# EAGLE design tmc2209 (EAGLE 7.3.0)
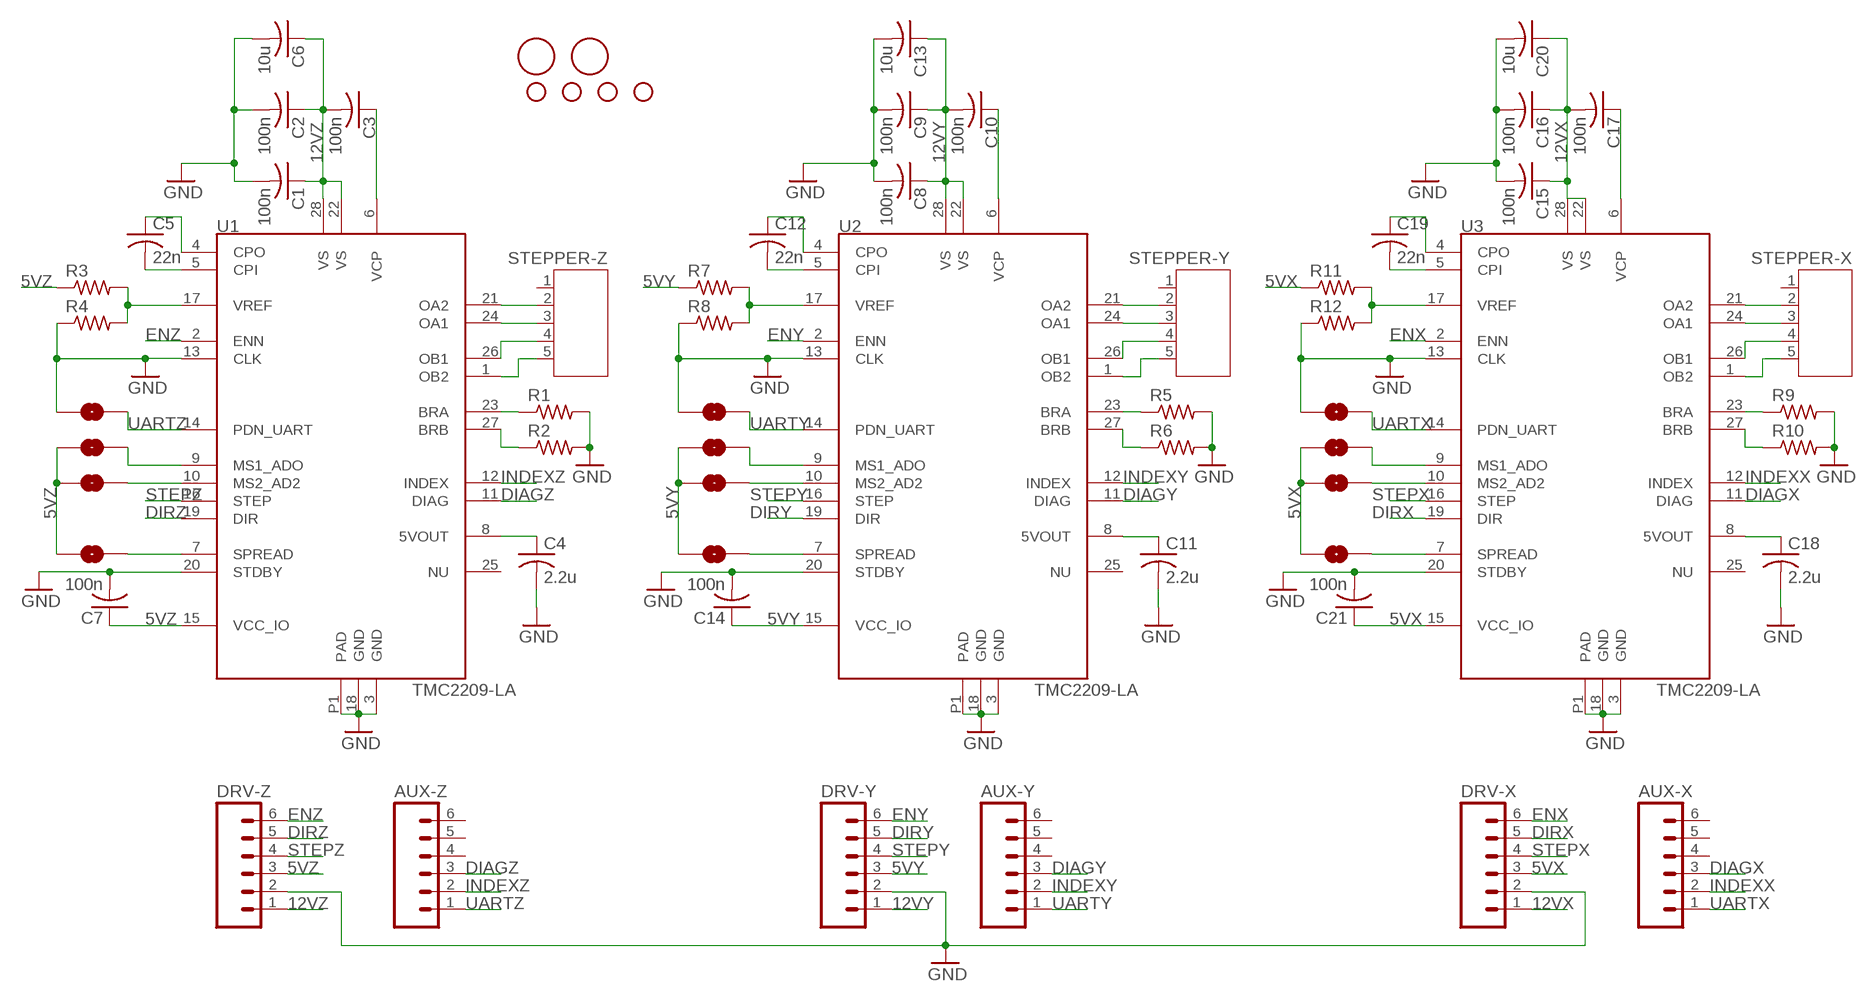
[diagram p0: schematic, sheet 1]

## Parts
AUX-X  M06LOCK  [1X06_LOCK]
AUX-Y  M06LOCK  [1X06_LOCK]
AUX-Z  M06LOCK  [1X06_LOCK]
C1  100n  C-USC0603  [C0603]
C2  100n  C-USC0603  [C0603]
C3  100n  C-USC0603  [C0603]
C4  2.2u  C-USC1206  [C1206]
C5  22n  C-USC0603  [C0603]
C6  10u  C-USC1206  [C1206]
C7  100n  C-USC0603  [C0603]
C8  100n  C-USC0603  [C0603]
C9  100n  C-USC0603  [C0603]
C10  100n  C-USC0603  [C0603]
C11  2.2u  C-USC1206  [C1206]
C12  22n  C-USC0603  [C0603]
C13  10u  C-USC1206  [C1206]
C14  100n  C-USC0603  [C0603]
C15  100n  C-USC0603  [C0603]
C16  100n  C-USC0603  [C0603]
C17  100n  C-USC0603  [C0603]
C18  2.2u  C-USC1206  [C1206]
C19  22n  C-USC0603  [C0603]
C20  10u  C-USC1206  [C1206]
C21  100n  C-USC0603  [C0603]
DRV-X  M06LOCK  [1X06_LOCK]
DRV-Y  M06LOCK  [1X06_LOCK]
DRV-Z  M06LOCK  [1X06_LOCK]
PDX  SOLDERJUMPERNO  [SJ_2S-NO]
PDY  SOLDERJUMPERNO  [SJ_2S-NO]
PDZ  SOLDERJUMPERNO  [SJ_2S-NO]
R1  R-US_R0805  [R0805]
R2  R-US_R0805  [R0805]
R3  R-US_R0603  [R0603]
R4  R-US_R0603  [R0603]
R5  R-US_R0805  [R0805]
R6  R-US_R0805  [R0805]
R7  R-US_R0603  [R0603]
R8  R-US_R0603  [R0603]
R9  R-US_R0805  [R0805]
R10  R-US_R0805  [R0805]
R11  R-US_R0603  [R0603]
R12  R-US_R0603  [R0603]
SJ2  SOLDERJUMPERNO  [SJ_2S-NO]
SJ3  SOLDERJUMPERNO  [SJ_2S-NO]
SJ5  SOLDERJUMPERNO  [SJ_2S-NO]
SJ6  SOLDERJUMPERNO  [SJ_2S-NO]
SJ8  SOLDERJUMPERNO  [SJ_2S-NO]
SJ9  SOLDERJUMPERNO  [SJ_2S-NO]
SJ10  SOLDERJUMPERNO  [SJ_2S-NO]
SJ11  SOLDERJUMPERNO  [SJ_2S-NO]
SJ12  SOLDERJUMPERNO  [SJ_2S-NO]
STANDOFF1  STAND-OFFTIGHT  [STAND-OFF-TIGHT]
STANDOFF2  STAND-OFFTIGHT  [STAND-OFF-TIGHT]
STANDOFF3  STAND-OFFTIGHT  [STAND-OFF-TIGHT]
STANDOFF4  STAND-OFFTIGHT  [STAND-OFF-TIGHT]
STEPPER-X  JST-PH5  [JST-PH5]
STEPPER-Y  JST-PH5  [JST-PH5]
STEPPER-Z  JST-PH5  [JST-PH5]
U1  TMC2209-LA  [QFN28-5X5-XLEP]
U2  TMC2209-LA  [QFN28-5X5-XLEP]
U3  TMC2209-LA  [QFN28-5X5-XLEP]
U$1  FIDUCIAL  [FIDUCIAL_1MM]
U$2  FIDUCIAL  [FIDUCIAL_1MM]

## Nets
5VX: C21.1 DRV-X.3 R11.1 SJ8.1 SJ9.1 SJ12.1 U3.15(VCC_IO)
5VY: C14.1 DRV-Y.3 R7.1 SJ5.1 SJ6.1 SJ11.1 U2.15(VCC_IO)
5VZ: C7.1 DRV-Z.3 R3.1 SJ2.1 SJ3.1 SJ10.1 U1.15(VCC_IO)
12VX: C15.1 C16.1 C17.2 C20.1 DRV-X.1 U3.22(VS) U3.28(VS)
12VY: C8.1 C9.1 C10.2 C13.1 DRV-Y.1 U2.22(VS) U2.28(VS)
12VZ: C1.1 C2.1 C3.2 C6.1 DRV-Z.1 U1.22(VS) U1.28(VS)
DIAGX: AUX-X.3 U3.11(DIAG)
DIAGY: AUX-Y.3 U2.11(DIAG)
DIAGZ: AUX-Z.3 U1.11(DIAG)
DIRX: DRV-X.5 U3.19(DIR)
DIRY: DRV-Y.5 U2.19(DIR)
DIRZ: DRV-Z.5 U1.19(DIR)
ENX: DRV-X.6 U3.2(ENN)
ENY: DRV-Y.6 U2.2(ENN)
ENZ: DRV-Z.6 U1.2(ENN)
GND: C1.2 C2.2 C4.2 C6.2 C7.2 C8.2 C9.2 C11.2 C13.2 C14.2 C15.2 C16.2 C18.2 C20.2 C21.2 DRV-X.2 DRV-Y.2 DRV-Z.2 PDX.1 PDY.1 PDZ.1 R1.2 R2.2 R4.1 R5.2 R6.2 R8.1 R9.2 R10.2 R12.1 U1.3(GND) U1.13(CLK) U1.18(GND) U1.20(STDBY) U1.P1(PAD) U2.3(GND) U2.13(CLK) U2.18(GND) U2.20(STDBY) U2.P1(PAD) U3.3(GND) U3.13(CLK) U3.18(GND) U3.20(STDBY) U3.P1(PAD)
INDEXX: AUX-X.2 U3.12(INDEX)
INDEXY: AUX-Y.2 U2.12(INDEX)
INDEXZ: AUX-Z.2 U1.12(INDEX)
N$1: STEPPER-Z.5 U1.1(OB2)
N$2: STEPPER-Z.4 U1.26(OB1)
N$3: STEPPER-Z.3 U1.24(OA1)
N$4: STEPPER-Z.2 U1.21(OA2)
N$5: STEPPER-Y.5 U2.1(OB2)
N$6: STEPPER-Y.4 U2.26(OB1)
N$7: STEPPER-Y.3 U2.24(OA1)
N$8: STEPPER-Y.2 U2.21(OA2)
N$9: STEPPER-X.2 U3.21(OA2)
N$10: STEPPER-X.3 U3.24(OA1)
N$11: STEPPER-X.4 U3.26(OB1)
N$12: STEPPER-X.5 U3.1(OB2)
N$13: R5.1 U2.23(BRA)
N$14: C11.1 U2.8(5VOUT)
N$15: SJ2.2 U1.9(MS1_ADO)
N$16: SJ3.2 U1.10(MS2_AD2)
N$17: SJ6.2 U2.10(MS2_AD2)
N$18: R6.1 U2.27(BRB)
N$19: C18.1 U3.8(5VOUT)
N$20: C17.1 U3.6(VCP)
N$22: C12.2 U2.5(CPI)
N$23: C12.1 U2.4(CPO)
N$24: C19.2 U3.5(CPI)
N$25: SJ5.2 U2.9(MS1_ADO)
N$26: C19.1 U3.4(CPO)
N$27: SJ12.2 U3.7(SPREAD)
N$28: SJ11.2 U2.7(SPREAD)
N$29: SJ9.2 U3.10(MS2_AD2)
N$30: SJ8.2 U3.9(MS1_ADO)
N$31: R11.2 R12.2 U3.17(VREF)
N$32: R7.2 R8.2 U2.17(VREF)
N$34: C10.1 U2.6(VCP)
N$40: SJ10.2 U1.7(SPREAD)
N$51: R9.1 U3.23(BRA)
N$52: R10.1 U3.27(BRB)
N$53: R1.1 U1.23(BRA)
N$54: R2.1 U1.27(BRB)
N$55: R3.2 R4.2 U1.17(VREF)
N$56: C4.1 U1.8(5VOUT)
N$57: C5.2 U1.5(CPI)
N$58: C5.1 U1.4(CPO)
N$59: C3.1 U1.6(VCP)
STEPX: DRV-X.4 U3.16(STEP)
STEPY: DRV-Y.4 U2.16(STEP)
STEPZ: DRV-Z.4 U1.16(STEP)
UARTX: AUX-X.1 PDX.2 U3.14(PDN_UART)
UARTY: AUX-Y.1 PDY.2 U2.14(PDN_UART)
UARTZ: AUX-Z.1 PDZ.2 U1.14(PDN_UART)
Unconnected: AUX-X.4 AUX-X.5 AUX-X.6 AUX-Y.4 AUX-Y.5 AUX-Y.6 AUX-Z.4 AUX-Z.5 AUX-Z.6 STEPPER-X.1 STEPPER-Y.1 STEPPER-Z.1 U1.25(NU) U2.25(NU) U3.25(NU)

## Library data of the parts
AUX-X AUX-Y AUX-Z DRV-X DRV-Y DRV-Z = SparkFun-Connectors:M06: Header 6 Standard 6-pin 0.1" header. Use with straight break away headers (SKU : PRT-00116), right angle break away headers (PRT-00553), swiss pins (PRT-00743), machine pins (PRT-00117), and female headers (PRT-00115). Molex polarized connector foot print use with SKU : PRT-08094 with associated crimp pins and housings. NOTES ON THE VARIANTS LOCK and LOCK_LONGPADS... This footprint was designed to help hold the alignment of a through-hole component (i.e. 6-pin header) while soldering it into place. You may notice that each hole has been shifted either up or down by 0.005 of an inch from it's more standard position (which is a perfectly straight line). This slight alteration caused the pins (the squares in the middle) to touch the edges of the holes. Because they are alternating, it causes a "brace" to hold the component in place. 0.005 has proven to be the perfect amount of "off-center" position when using our standard breakaway headers. Although looks a little odd when you look at the bare footprint, once you have a header in there, the alteration is very hard to notice. Also,if you push a header all the way into place, it is covered up entirely on the bottom side. This idea of altering the position of holes to aid alignment will be further integrated into the Sparkfun Library for other footprints. It can help hold any component with 3 or more connection pins.
C1-C21 = adafruit:C-US: CAPACITOR, American symbol
PDX PDY PDZ SJ2 SJ3 SJ5 SJ6 SJ8-SJ12 = SparkFun-Retired:SOLDERJUMPER: Solder Jumper Standard SMD solder jumper. Used to automate production. Two varients : Normally Open and Normally Closed are the same, but have different paste layers. NC will have a large amount of paste and should jumper during reflow.
R1-R12 = adafruit:R-US_: RESISTOR, American symbol
STANDOFF1-STANDOFF4 = SparkFun-Electromechanical:STAND-OFF: #4 Stand Off This is the mechanical footprint for a #4 phillips button head screw. Use the keepout ring to avoid running the screw head into surrounding components. SKU : PRT-00447
STEPPER-X STEPPER-Y STEPPER-Z = jst-ph:JST-PH5
U1-U3 = borkedlabs-powerics:TMC2209; MPN: TMC2209-LA; PACKAGE: QFN28-5x5
U$1 U$2 = adafruit:FIDUCIAL: For use by pick and place machines to calibrate the vision/machine, 1mm By microbuilder.eu

## Board
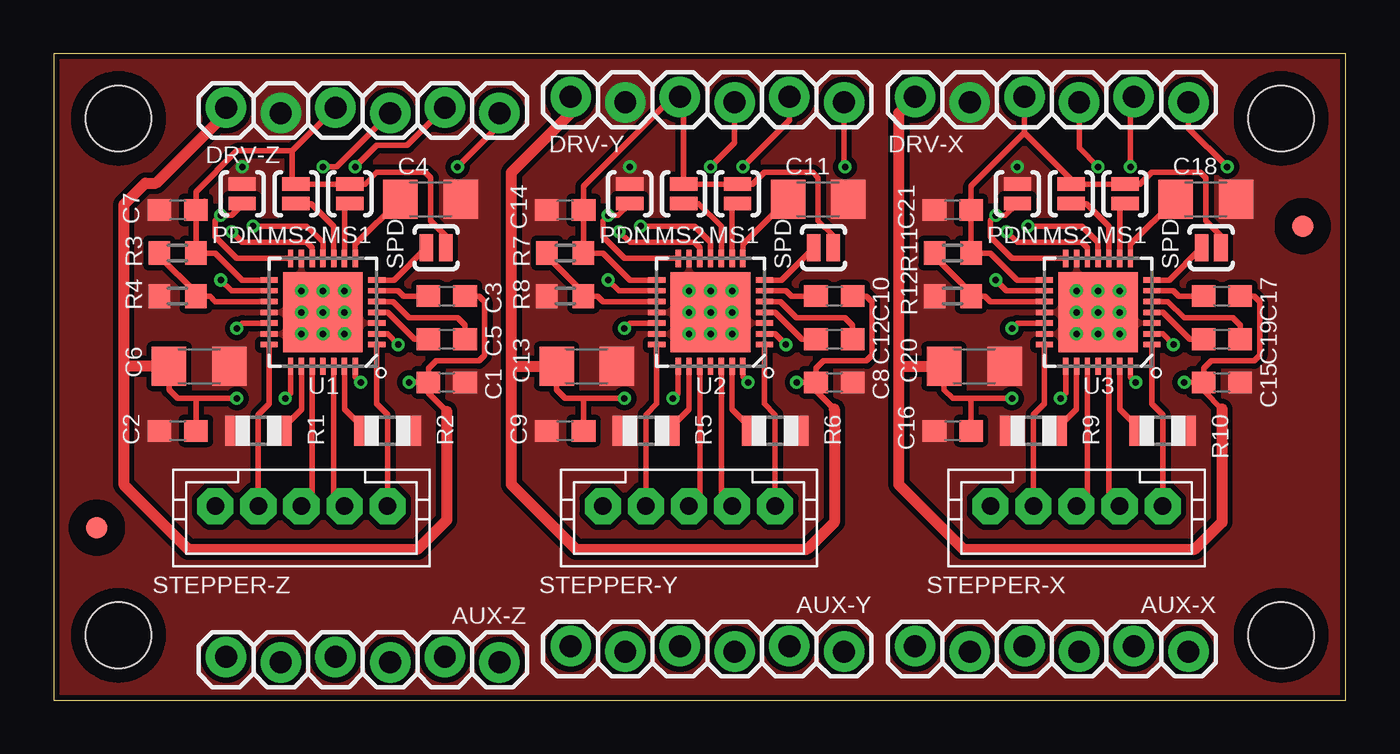
[diagram p1: board, top side]
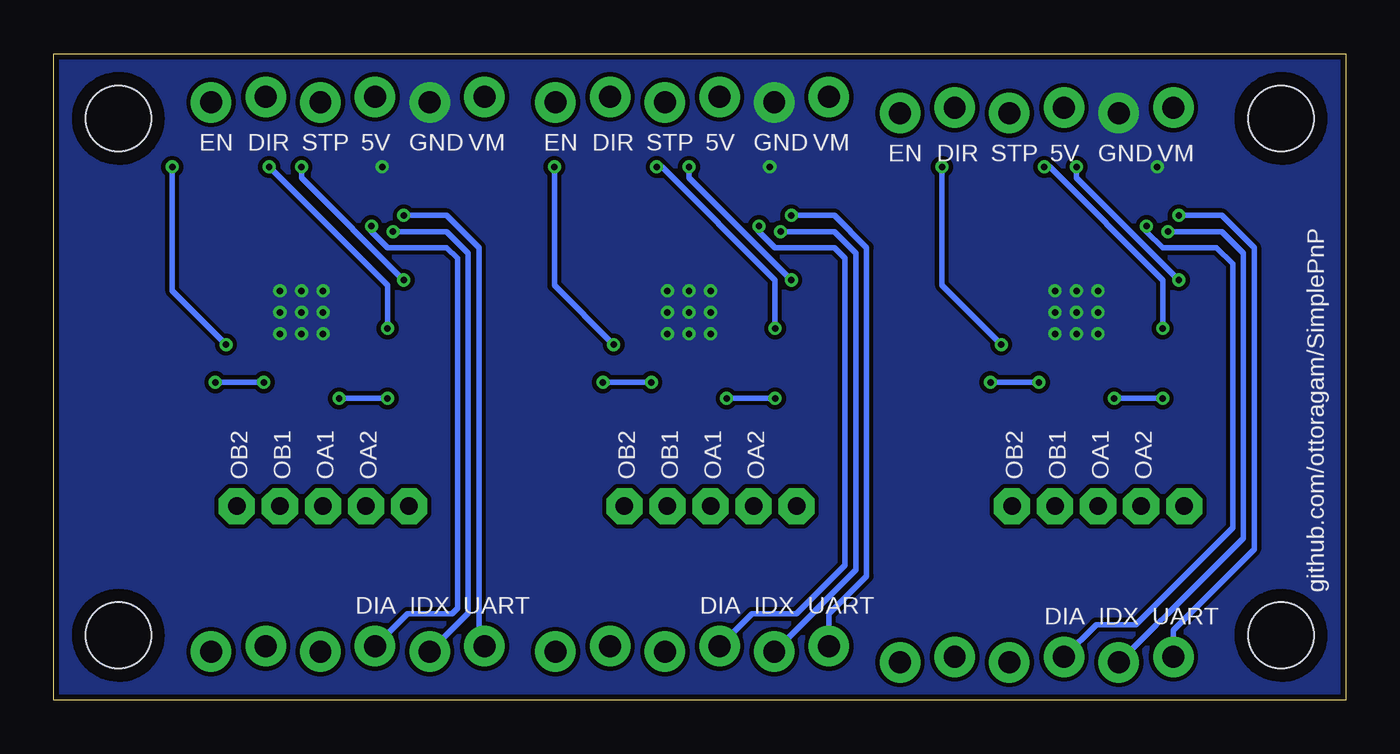
[diagram p2: board, bottom side, seen from below]

Size 60 x 30 mm. Coordinates in mm from the lower left corner, seen from the top.
Outline: 0,0 60,0 60,30 0,30 0,0
Copper layers (1*16): Top 0.035mm / dielectric 1.5mm / Bottom 0.035mm
Design rules "default": minimum track width 6mil, minimum drill 0.3mm, track to track 6mil, track to pad 6mil, pad to pad 6mil, via to via 6mil, smd to smd 0mil, copper to edge 0.25mm, drill to drill 0.25mm, minimum pad ring 10mil, minimum via ring 6mil, stop-mask expansion 2mil, vias tented up to drill 100mil, thermal gap 10mil

### Footprints (pad centres in the part's own frame; a part is rotated, then mirrored left to right if it is on the bottom)
1X06_LOCK = drill 1.016 pad 1.88: 1 0,0; 2 2.54,-0.254; 3 5.08,0; 4 7.62,-0.254; 5 10.16,0; 6 12.7,-0.254
C0603 = smd 1.1 x 1: 1 -0.85,0; 2 0.85,0
C1206 = smd 1.6 x 1.8: 1 -1.4,0; 2 1.4,0
SJ_2S-NO = smd 0.635 x 1.27: 1 -0.45,0; 2 0.45,0
R0805 = smd 1.1 x 1.4: 1 -1,0; 2 1,0
R0603 = smd 1 x 1.1: 1 -0.85,0; 2 0.85,0
STAND-OFF-TIGHT = hole 3.048: 0,0
JST-PH5 = drill 0.813 pad 1.676 octagon: 1 4,0; 2 2,0; 3 0,0; 4 -2,0; 5 -4,0
QFN28-5X5-XLEP = smd 0.8 x 0.25: 1 -2.5,1.5; 2 -2.5,1; 3 -2.5,0.5; 4 -2.5,0; 5 -2.5,-0.5; 6 -2.5,-1; 7 -2.5,-1.5; 15 2.5,-1.5; 16 2.5,-1; 17 2.5,-0.5; 18 2.5,0; 19 2.5,0.5; 20 2.5,1; 21 2.5,1.5 | smd 0.25 x 0.8: 8 -1.5,-2.5; 9 -1,-2.5; 10 -0.5,-2.5; 11 0,-2.5; 12 0.5,-2.5; 13 1,-2.5; 14 1.5,-2.5; 22 1.5,2.5; 23 1,2.5; 24 0.5,2.5; 25 0,2.5; 26 -0.5,2.5; 27 -1,2.5; 28 -1.5,2.5 | smd 3.7 x 3.7: P1 0,0
FIDUCIAL_1MM = smd 1 x 1: 1 0,0

### Placement (x,y rotation side)
AUX-X  40,2.5 0 top
AUX-Y  24,2.5 0 top
AUX-Z  8,2 0 top
C1  18.25,14.75 0 top
C2  5.75,12.5 180 top
C3  18.25,18.75 0 top
C4  17.5,23.25 0 top
C5  18.25,16.75 0 top
C6  6.75,15.5 0 top
C7  5.75,22.75 180 top
C8  36.25,14.75 0 top
C9  23.75,12.5 180 top
C10  36.25,18.75 0 top
C11  35.5,23.25 0 top
C12  36.25,16.75 0 top
C13  24.75,15.5 0 top
C14  23.75,22.75 180 top
C15  54.25,14.75 0 top
C16  41.75,12.5 180 top
C17  54.25,18.75 0 top
C18  53.5,23.25 0 top
C19  54.25,16.75 0 top
C20  42.75,15.5 0 top
C21  41.75,22.75 180 top
DRV-X  40,28 0 top
DRV-Y  24,28 0 top
DRV-Z  8,27.5 0 top
PDX  44.75,23.5 270 top
PDY  26.75,23.5 270 top
PDZ  8.75,23.5 270 top
R1  9.5,12.5 180 top
R2  15.5,12.5 0 top
R3  5.75,20.75 180 top
R4  5.75,18.75 0 top
R5  27.5,12.5 180 top
R6  33.5,12.5 0 top
R7  23.75,20.75 180 top
R8  23.75,18.75 0 top
R9  45.5,12.5 180 top
R10  51.5,12.5 0 top
R11  41.75,20.75 180 top
R12  41.75,18.75 0 top
SJ2  13.75,23.5 270 top
SJ3  11.25,23.5 270 top
SJ5  31.75,23.5 270 top
SJ6  29.25,23.5 270 top
SJ8  49.75,23.5 270 top
SJ9  47.25,23.5 270 top
SJ10  17.75,21 180 top
SJ11  35.75,21 180 top
SJ12  53.75,21 180 top
STANDOFF1  3,3 0 top
STANDOFF2  57,27 0 top
STANDOFF3  3,27 0 top
STANDOFF4  57,3 0 top
STEPPER-X  47.5,9 180 top
STEPPER-Y  29.5,9 180 top
STEPPER-Z  11.5,9 180 top
U1  12.5,18 180 top
U2  30.5,18 180 top
U3  48.5,18 180 top
U$1  2,8 0 top
U$2  58,22 0 top

### Tracks (layer width: path | path; a pad name or v marks a point on that pad's centre or on a via)
5VX
  Top 0.25: SJ12.1 54.2,21.55 53.5,22.25 53.5,24.25 53.25,24.5 51,24.5 50.45,23.95 SJ8.1 SJ9.1 47.25,24.16 45.08,26.33 | U3.15 44.75,19.5 43.5,20.75 R11.1 C21.1 42.6,23.85 45.08,26.33 | 45.08,26.33 DRV-X.3
5VY
  Top 0.25: SJ11.1 36.2,21.55 35.5,22.25 35.5,24.25 35.25,24.5 33,24.5 32.45,23.95 SJ5.1 SJ6.1 29.25,27.83 DRV-Y.3 28.75,28 24.6,23.85 C14.1 R7.1 25.5,20.75 26.75,19.5 U2.15
5VZ
  Top 0.25: C7.1 R3.1 7.5,20.75 8.75,19.5 U1.15 | SJ10.1 18.2,21.55 17.5,22.25 17.5,24.25 17.25,24.5 15,24.5 14.45,23.95 SJ2.1 SJ3.1 11.08,24.12 11.08,25.5 | 7,23.15 C7.1 | DRV-Z.3 11.08,25.5 | 11.08,25.5 8.5,25.5 6.6,23.6 C7.1
12VX  (via drill 0.3 pad 0.6)
  Top 0.25: C17.2 55.75,18.75 56,18.5 56,16 55.75,15.75 53.75,15.75 53.4,15.4 C15.1 | U3.28 50,15 v50.25,14.75 | C16.1 42.6,14 | 42.6,14 v44.5,14 | v46.75,14 47,14.25 U3.22 | C20.1 41.35,14.4 41.75,14 42.6,14 | C15.1 53.4,14.35 54.25,13.5 | C15.1 v52.5,14.75
  Top 0.5: DRV-X.1 39.25,27.25 39.25,15.5 | 39.25,15.5 39.25,10 42.25,7 53,7 54.25,8.25 54.25,13.5 | 39.25,15.5 C20.1
  Bottom 0.25: v50.25,14.75 v52.5,14.75 | v44.5,14 v46.75,14
12VY  (via drill 0.3 pad 0.6)
  Top 0.25: C10.2 37.75,18.75 38,18.5 38,16 37.75,15.75 35.75,15.75 35.4,15.4 C8.1 | C9.1 24.6,14 | 24.6,14 v26.5,14 | v28.75,14 29,14.25 U2.22 | C13.1 23.35,14.4 23.75,14 24.6,14 | U2.28 32,15 v32.25,14.75 | C8.1 35.4,14.35 36.25,13.5 | v34.5,14.75 C8.1
  Top 0.5: 36.25,13.5 36.25,8.25 35,7 24.25,7 21.25,10 21.25,15.5 | 21.25,15.5 C13.1 | 21.25,15.5 21.25,24.5 24,27.25 DRV-Y.1
  Bottom 0.25: v26.5,14 v28.75,14 | v32.25,14.75 v34.5,14.75
12VZ  (via drill 0.3 pad 0.6)
  Top 0.25: U1.28 14,15 v14.25,14.75 | U1.22 11,14.25 v10.75,14 | v16.5,14.75 C1.1 | C3.2 19.75,18.75 20,18.5 20,16 19.75,15.75 17.75,15.75 17.4,15.4 C1.1 | C6.1 5.35,14.4 5.75,14 6.6,14 | C2.1 6.6,14 | 6.6,14 v8.5,14 | 18.25,13.4 17.4,14.25 C1.1
  Top 0.5: 3.25,15.5 3.25,23 4.25,24 4.75,24 8,27.25 DRV-Z.1 | 18.25,13.4 18.25,8.35 16.9,7 6.25,7 3.25,10 3.25,15.5 | C6.1 3.25,15.5
  Bottom 0.25: v14.25,14.75 v16.5,14.75 | v10.75,14 v8.5,14
DIAGX  (via drill 0.3 pad 0.6)
  Top 0.25: U3.11 48.5,21.25 47.75,22 v45.25,22
  Bottom 0.25: AUX-X.3 43.58,4 41.5,4 41.25,4.25 41.25,20.5 41.75,21 44.5,21 45.25,21.75 v45.25,22
DIAGY  (via drill 0.3 pad 0.6)
  Top 0.25: U2.11 30.5,21.25 29.75,22 v27.25,22
  Bottom 0.25: AUX-Y.3 27.58,4 25.5,4 23.25,6.25 23.25,20.5 23.75,21 26.5,21 27.25,21.75 v27.25,22
DIAGZ  (via drill 0.3 pad 0.6)
  Top 0.25: U1.11 12.5,21.25 11.75,22 v9.25,22
  Bottom 0.25: AUX-Z.3 11.58,3.5 9.75,3.5 5.25,8 5.25,20.25 6,21 8.5,21 9.25,21.75 v9.25,22
DIRX  (via drill 0.3 pad 0.6)
  Top 0.25: DRV-X.5 50,27.84 v50,24.75 | v44.5,17.25 44.75,17.5 U3.19
  Bottom 0.25: v50,24.75 44.5,19.25 v44.5,17.25
DIRY  (via drill 0.3 pad 0.6)
  Top 0.25: U2.19 26.75,17.5 v26.5,17.25 | DRV-Y.5 34.16,26.91 v32,24.75
  Bottom 0.25: v26.5,17.25 26.5,19.5 31.75,24.75 v32,24.75
DIRZ  (via drill 0.3 pad 0.6)
  Top 0.25: v8.5,17.25 8.75,17.5 U1.19 | v14,24.75 15,25.75 16.41,25.75 DRV-Z.5
  Bottom 0.25: v14,24.75 13.75,24.75 8.5,19.5 v8.5,17.25
ENX  (via drill 0.3 pad 0.6)
  Top 0.25: U3.2 51.5,17 v52,16.5 | v54.5,24.75 52.7,26.55 DRV-X.6
  Bottom 0.25: v54.5,24.75 54.5,19 v52,16.5
ENY  (via drill 0.3 pad 0.6)
  Top 0.25: U2.2 33.5,17 v34,16.5 | v36.75,24.75 36.7,24.8 DRV-Y.6
  Bottom 0.25: v36.75,24.75 36.75,19.25 v34,16.5
ENZ  (via drill 0.3, 0.3 pad 0.6)
  Top 0.25: U1.2 15.5,17 v16,16.5 | v18.75,24.75 20.7,26.7 DRV-Z.6
  Bottom 0.25: v16,16.5 18.75,19.25 v18.75,24.75
GND  (via drill 0.3 pad 0.6)
  other vias: 11.5,19 12.5,19 13.5,19 13.5,18 12.5,18 11.5,18 11.5,17 12.5,17 13.5,17 8.75,24.75 29.5,19 30.5,19 31.5,19 31.5,18 31.5,17 29.5,17 30.5,17 30.5,18 29.5,18 47.5,19 49.5,19 49.5,17 47.5,17 47.5,18 48.5,19 49.5,18 48.5,17 48.5,18 26.75,24.75 44.75,24.75
  pour Bottom (isolate 0.2, rank 6, no thermals): 0,30 60,30 60,0 0,0
  pour Top (isolate 0.25, rank 6, no thermals): 0,0 60,0 60,30 0,30
INDEXX  (via drill 0.3 pad 0.6)
  Top 0.25: U3.12 48,21 47.75,21.25 44.75,21.25 v44.25,21.75
  Bottom 0.25: AUX-X.2 40.75,4.04 40.75,20.75 41.75,21.75 v44.25,21.75
INDEXY  (via drill 0.3 pad 0.6)
  Top 0.25: U2.12 30,21 29.75,21.25 26.75,21.25 v26.25,21.75
  Bottom 0.25: AUX-Y.2 22.75,6.04 22.75,20.75 23.75,21.75 v26.25,21.75
INDEXZ  (via drill 0.3 pad 0.6)
  Top 0.25: U1.12 12,21 11.75,21.25 8.75,21.25 v8.25,21.75
  Bottom 0.25: v8.25,21.75 5.75,21.75 4.75,20.75 4.75,7.5 8.25,4 8.79,3.5 AUX-Z.2
N$1
  Top 0.25: U1.1 15,13.75 15.5,13.25 STEPPER-Z.5
N$2
  Top 0.25: U1.26 13,9.5 STEPPER-Z.4
N$3
  Top 0.25: U1.24 12,9.5 STEPPER-Z.3
N$4
  Top 0.25: U1.21 10,13.75 9.5,13.25 STEPPER-Z.2
N$5
  Top 0.25: U2.1 33,13.75 33.5,13.25 STEPPER-Y.5
N$6
  Top 0.25: U2.26 31,9.5 STEPPER-Y.4
N$7
  Top 0.25: U2.24 30,9.5 STEPPER-Y.3
N$8
  Top 0.25: U2.21 28,13.75 27.5,13.25 STEPPER-Y.2
N$9
  Top 0.25: U3.21 46,13.75 45.5,13.25 STEPPER-X.2
N$10
  Top 0.25: U3.24 48,9.5 STEPPER-X.3
N$11
  Top 0.25: U3.26 49,9.5 STEPPER-X.4
N$12
  Top 0.25: U3.1 51,13.75 51.5,13.25 STEPPER-X.5
N$13
  Top 0.25: U2.23 29.5,13.5 R5.1
N$14
  Top 0.25: U2.8 32,21.15 C11.1
N$15
  Top 0.25: SJ2.2 13.5,22.8 U1.9
N$16
  Top 0.25: SJ3.2 11.95,23.05 13,22 U1.10
N$17
  Top 0.25: U2.10 31,22 29.95,23.05 SJ6.2
N$18
  Top 0.25: U2.27 31.5,13.5 R6.1
N$19
  Top 0.25: U3.8 50,21.15 C18.1
N$20
  Top 0.25: U3.6 52,19 52.25,18.75 C17.1
N$22
  Top 0.25: U2.5 33.75,18.5 34.5,17.75 36.75,17.75 37.1,17.4 C12.2
N$23
  Top 0.25: U2.4 33.5,18 34.75,16.75 C12.1
N$24
  Top 0.25: C19.2 55.1,17.4 54.75,17.75 52.5,17.75 51.75,18.5 U3.5
N$25
  Top 0.25: U2.9 31.5,22.8 SJ5.2
N$26
  Top 0.25: U3.4 51.5,18 52.75,16.75 C19.1
N$27
  Top 0.25: U3.7 51.8,19.5 SJ12.2
N$28
  Top 0.25: U2.7 33.8,19.5 SJ11.2
N$29
  Top 0.25: U3.10 49,22 47.95,23.05 SJ9.2
N$30
  Top 0.25: U3.9 49.5,22.8 SJ8.2
N$31
  Top 0.25: U3.17 43.5,18.5 43.25,18.75 R12.2 42.6,18.9 40.9,20.6 R11.2
N$32
  Top 0.25: U2.17 25.5,18.5 25.25,18.75 R8.2 24.6,18.9 22.9,20.6 R7.2
N$34
  Top 0.25: U2.6 34,19 34.25,18.75 C10.1
N$40
  Top 0.25: U1.7 15.8,19.5 SJ10.2
N$51
  Top 0.25: U3.23 47.5,13.5 R9.1
N$52
  Top 0.25: U3.27 49.5,13.5 R10.1
N$53
  Top 0.25: U1.23 11.5,13.5 R1.1
N$54
  Top 0.25: U1.27 13.5,13.5 R2.1
N$55
  Top 0.25: U1.17 7.5,18.5 7.25,18.75 R4.2 6.6,18.9 4.9,20.6 R3.2
N$56
  Top 0.25: C4.1 14,21.15 U1.8
N$57
  Top 0.25: U1.5 15.75,18.5 16.5,17.75 18.75,17.75 19.1,17.4 C5.2
N$58
  Top 0.25: C5.1 16.75,16.75 15.5,18 U1.4
N$59
  Top 0.25: U1.6 16,19 16.25,18.75 C3.1
STEPX  (via drill 0.3 pad 0.6)
  Top 0.25: DRV-X.4 47.62,25.63 v48.5,24.75 | v43.75,19.5 44.25,19 U3.16
  Bottom 0.25: v48.5,24.75 48.5,24.25 v43.75,19.5
STEPY  (via drill 0.3 pad 0.6)
  Top 0.25: DRV-Y.4 31.62,25.87 v30.5,24.75 | v25.75,19.5 26.25,19 U2.16
  Bottom 0.25: v30.5,24.75 30.5,24.25 v25.75,19.5
STEPZ  (via drill 0.3 pad 0.6)
  Top 0.25: U1.16 8.25,19 v7.75,19.5 | DRV-Z.4 13.12,24.75 v12.5,24.75
  Bottom 0.25: v12.5,24.75 12.5,24.25 v7.75,19.5
UARTX  (via drill 0.3 pad 0.6)
  Top 0.25: PDX.2 44.2,22.5 v43.75,22.5 43.5,22.25 43.5,21.5 44.5,20.5 U3.14
  Bottom 0.25: AUX-X.1 40.25,2.75 40.25,21 41.75,22.5 v43.75,22.5
UARTY  (via drill 0.3 pad 0.6)
  Top 0.25: PDY.2 26.2,22.5 v25.75,22.5 25.5,22.25 25.5,21.5 26.5,20.5 U2.14
  Bottom 0.25: v25.75,22.5 23.75,22.5 22.25,21 22.25,5.75 24,4 AUX-Y.1
UARTZ  (via drill 0.3 pad 0.6)
  Top 0.25: PDZ.2 8.75,23 8.25,22.5 v7.75,22.5 7.5,22.25 7.5,21.5 8.5,20.5 U1.14
  Bottom 0.25: v7.75,22.5 5.75,22.5 4.25,21 4.25,7 8,3.25 AUX-Z.1

### Text on the board
tNames: PDN | MS2 | MS1 | PDN | MS2 | MS1 | PDN | MS2 | MS1 | SPD | SPD | SPD
bNames: VM | GND | 5V | STP | DIR | EN | VM | GND | 5V | STP | DIR | EN | VM | GND | 5V | STP | DIR | EN | OA2 | OA1 | OB1 | OB2 | OA2 | OA1 | OB1 | OB2 | OA2 | OA1 | OB1 | OB2 | github.com/ottoragam/SimplePnP | UART | IDX | DIA | UART | IDX | DIA | UART | IDX | DIA